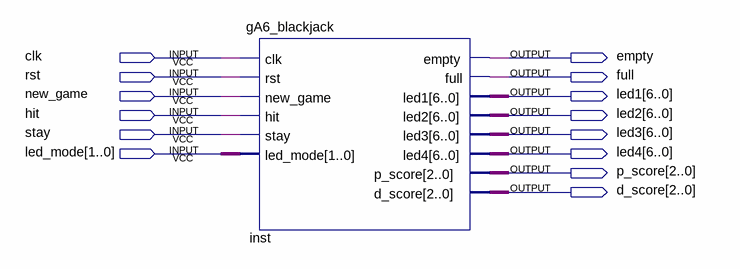
[diagram p0: schematic sheet]
// Quartus schematic gA6_lab5.bdf as structural Verilog: 1 symbols, 14 pins
module gA6_lab5 (
  input  clk,
  input  rst,
  input  new_game,
  input  hit,
  input  stay,
  input  [1:0] led_mode,
  output empty,
  output full,
  output [6:0] led1,
  output [6:0] led2,
  output [6:0] led3,
  output [6:0] led4,
  output [2:0] p_score,
  output [2:0] d_score
);

  gA6_blackjack inst (
    .clk(clk), .rst(rst), .new_game(new_game), .hit(hit), .stay(stay), .led_mode(led_mode), .empty(empty),
    .full(full), .led1(led1), .led2(led2), .led3(led3), .led4(led4), .p_score(p_score), .d_score(d_score));
endmodule
